# Altium schematic sheet power_filter.SchDoc: =GlobalProjectName
size 209 x 297 mm; ApprovedBy: Утвердил; CheckedBy: Проверил; Author: Разработал; SheetNumber: 2; SheetTotal: 6; PageSetup: Record=PageOptions|CenterHorizontal=True|CenterVertical=True|PrintScale=1.00|XCorrection=1.00|YCorrection=1.00|PrintKind=1|BorderSize=5000000|LeftOffset=0|BottomOffset=0|Orientation=2|PaperLength=1000|PaperWidth=1000|Scale=100|PaperSource=15|PrintQuality=1200|MediaType=1|DitherType=10|PaperKind=A3|PrintScaleMode=1; Weight: -; ScaleFactor: -; NormInspection: Норм.Контр.
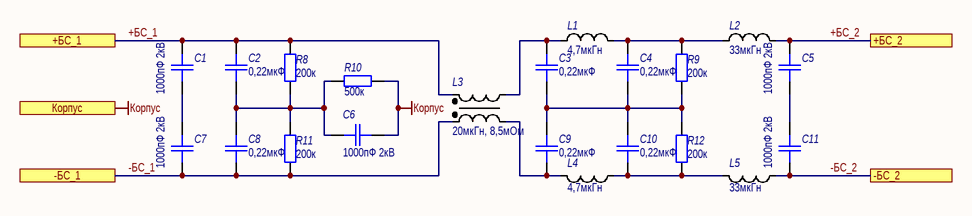
[diagram p0: power_filter.SchDoc]

## Parts
C1  1000пФ 2кВ  [SMD_1206]
C2  0,22мкФ  [SMD_0805]
C3  0,22мкФ  [SMD_0805]
C4  0,22мкФ  [SMD_0805]
C5  1000пФ 2кВ  [SMD_1206]
C6  1000пФ 2кВ  [SMD_1206]
C7  1000пФ 2кВ  [SMD_1206]
C8  0,22мкФ  [SMD_0805]
C9  0,22мкФ  [SMD_0805]
C10  0,22мкФ  [SMD_0805]
C11  1000пФ 2кВ  [SMD_1206]
L1  4,7мкГн  [SMD_0805]
L2  33мкГн  [SMD_size_B]
L3  20мкГн, 8,5мОм  [PLT10HH]
L4  4,7мкГн  [SMD_0805]
L5  33мкГн  [SMD_size_B]
R8  200к  [SMD_0805]
R9  200к  [SMD_0805]
R10  500к  [SMD_0805]
R11  200к  [SMD_0805]
R12  200к  [SMD_0805]

## Ports
+БС_1, +БС_2, -БС_1, -БС_2, Корпус

## Nets
Корпус: C6.1 R10.2 ; port Корпус
+БС_1: C1.1 C2.2 L3.3 R8.2 ; port +БС_1
+БС_2: C5.1 L2.2 ; port +БС_2
-БС_1: C7.2 C8.1 L3.2 R11.1 ; port -БС_1
-БС_2: C11.2 L5.1 ; port -БС_2
NetC1_2: C1.2 C7.1
NetC2_1: C2.1 C6.2 C8.2 R8.1 R10.1 R11.2
NetC3_1: C3.1 C4.1 C9.2 C10.2 R9.1 R12.2
NetC3_2: C3.2 L1.1 L3.4
NetC4_2: C4.2 L1.2 L2.1 R9.2
NetC5_2: C5.2 C11.1
NetC9_1: C9.1 L3.1 L4.2
NetC10_1: C10.1 L4.1 L5.2 R12.1

## Notes on the sheet
- Подп. и дата
- Инв. № дубл.
- Взам. инв. №
- Инв. № подл.
- Изм.
- Лист
- № докум.
- Подп.
- Дата
- Форма 2а ГОСТ 2.104-2006
- Копировал
- Формат А4

## Library data of the parts
C1-C11 = Capacitor: Назначение: SMD-конденсатор; Наименование: Конденсатор; Потребление, Вт: 0
  C1 C5-C7 C11: Value: 1000пФ 2кВ
  C2-C4 C8-C10: Value: 0,22мкФ
L1 L2 L4 L5 = Inductor: Наименование: Индуктивность; Назначение: SMD-индуктивность; Потребление, Вт: 0,010
  L1 L4: Value: 4,7мкГн
  L2 L5: Value: 33мкГн
L3 = Inductor_coupled: Coupled inductor; Назначение: Связанная индуктивность; Наименование: PLT10HH1026R0PN; Потребление, Вт: 0,1; Value: 20мкГн, 8,5мОм
R8-R12 = Resistor: Наименование: Резистор; Назначение: SMD-резистор; Потребление, Вт: 0,001
  R8 R9 R11 R12: Value: 200к
  R10: Value: 500к